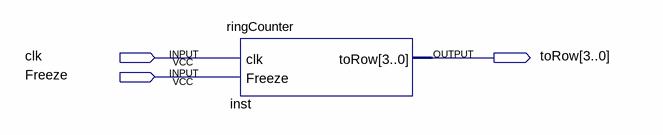
[diagram p0: schematic sheet]
// Quartus schematic testringcounter.bdf as structural Verilog: 1 symbols, 3 pins
module testringcounter (
  input  clk,
  input  Freeze,
  output [3:0] toRow
);

  ringCounter inst (.clk(clk), .Freeze(Freeze), .toRow(toRow));
endmodule
